# Altium schematic sheet SevenSegInterface.SchDoc
size A3; SheetNumber: 2; SheetTotal: 2
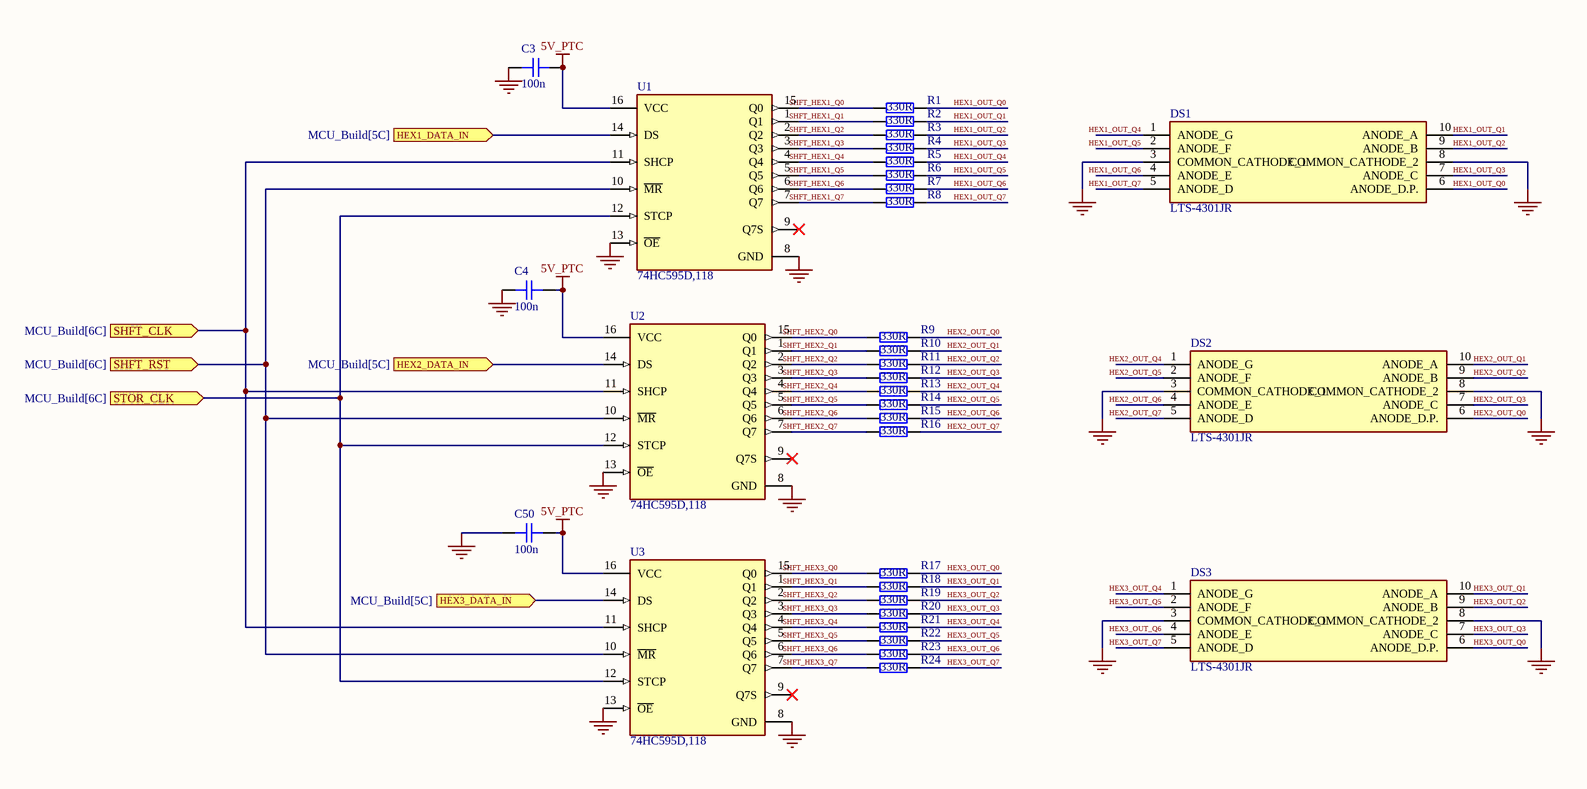
[diagram p0: SevenSegInterface.SchDoc]

## Parts
C3  100n  [CAP_0402]
C4  100n  [CAP_0402]
C50  100n  [CAP_0402]
DS1  LTS-4301JR  [DIPS762W50P254L1290H725Q10N]
DS2  LTS-4301JR  [DIPS762W50P254L1290H725Q10N]
DS3  LTS-4301JR  [DIPS762W50P254L1290H725Q10N]
R1  330R  [RES_0402]
R2  330R  [RES_0402]
R3  330R  [RES_0402]
R4  330R  [RES_0402]
R5  330R  [RES_0402]
R6  330R  [RES_0402]
R7  330R  [RES_0402]
R8  330R  [RES_0402]
R9  330R  [RES_0402]
R10  330R  [RES_0402]
R11  330R  [RES_0402]
R12  330R  [RES_0402]
R13  330R  [RES_0402]
R14  330R  [RES_0402]
R15  330R  [RES_0402]
R16  330R  [RES_0402]
R17  330R  [RES_0402]
R18  330R  [RES_0402]
R19  330R  [RES_0402]
R20  330R  [RES_0402]
R21  330R  [RES_0402]
R22  330R  [RES_0402]
R23  330R  [RES_0402]
R24  330R  [RES_0402]
U1  74HC595D,118  [FP-SOT109-1-IPC_C]
U2  74HC595D,118  [FP-SOT109-1-IPC_C]
U3  74HC595D,118  [FP-SOT109-1-IPC_C]

## Ports
HEX1_DATA_IN (in, see MCU_Build[5C]), HEX2_DATA_IN (in, see MCU_Build[5C]), HEX3_DATA_IN (in, see MCU_Build[5C]), SHFT_CLK (in, see MCU_Build[6C]), SHFT_RST (in, see MCU_Build[6C]), STOR_CLK (in, see MCU_Build[6C])

## Nets
5V_PTC: C3.1 C4.1 C50.1 U1.16(VCC) U2.16(VCC) U3.16(VCC)
GND: C3.2 C4.2 C50.2 DS1.3(COMMON_CATHODE_1) DS1.8(COMMON_CATHODE_2) DS2.3(COMMON_CATHODE_1) DS2.8(COMMON_CATHODE_2) DS3.3(COMMON_CATHODE_1) DS3.8(COMMON_CATHODE_2) U1.8(GND) U1.13(~{OE}) U2.8(GND) U2.13(~{OE}) U3.8(GND) U3.13(~{OE})
HEX1_DATA_IN: U1.14(DS) ; port HEX1_DATA_IN
HEX1_OUT_Q0: DS1.6(ANODE_D.P.) R1.1
HEX1_OUT_Q1: DS1.10(ANODE_A) R2.1
HEX1_OUT_Q2: DS1.9(ANODE_B) R3.1
HEX1_OUT_Q3: DS1.7(ANODE_C) R4.1
HEX1_OUT_Q4: DS1.1(ANODE_G) R5.1
HEX1_OUT_Q5: DS1.2(ANODE_F) R6.1
HEX1_OUT_Q6: DS1.4(ANODE_E) R7.1
HEX1_OUT_Q7: DS1.5(ANODE_D) R8.1
HEX2_DATA_IN: U2.14(DS) ; port HEX2_DATA_IN
HEX2_OUT_Q0: DS2.6(ANODE_D.P.) R9.1
HEX2_OUT_Q1: DS2.10(ANODE_A) R10.1
HEX2_OUT_Q2: DS2.9(ANODE_B) R11.1
HEX2_OUT_Q3: DS2.7(ANODE_C) R12.1
HEX2_OUT_Q4: DS2.1(ANODE_G) R13.1
HEX2_OUT_Q5: DS2.2(ANODE_F) R14.1
HEX2_OUT_Q6: DS2.4(ANODE_E) R15.1
HEX2_OUT_Q7: DS2.5(ANODE_D) R16.1
HEX3_DATA_IN: U3.14(DS) ; port HEX3_DATA_IN
HEX3_OUT_Q0: DS3.6(ANODE_D.P.) R17.1
HEX3_OUT_Q1: DS3.10(ANODE_A) R18.1
HEX3_OUT_Q2: DS3.9(ANODE_B) R19.1
HEX3_OUT_Q3: DS3.7(ANODE_C) R20.1
HEX3_OUT_Q4: DS3.1(ANODE_G) R21.1
HEX3_OUT_Q5: DS3.2(ANODE_F) R22.1
HEX3_OUT_Q6: DS3.4(ANODE_E) R23.1
HEX3_OUT_Q7: DS3.5(ANODE_D) R24.1
SHFT_CLK: U1.11(SHCP) U2.11(SHCP) U3.11(SHCP) ; port SHFT_CLK
SHFT_HEX1_Q0: R1.2 U1.15(Q0)
SHFT_HEX1_Q1: R2.2 U1.1(Q1)
SHFT_HEX1_Q2: R3.2 U1.2(Q2)
SHFT_HEX1_Q3: R4.2 U1.3(Q3)
SHFT_HEX1_Q4: R5.2 U1.4(Q4)
SHFT_HEX1_Q5: R6.2 U1.5(Q5)
SHFT_HEX1_Q6: R7.2 U1.6(Q6)
SHFT_HEX1_Q7: R8.2 U1.7(Q7)
SHFT_HEX2_Q0: R9.2 U2.15(Q0)
SHFT_HEX2_Q1: R10.2 U2.1(Q1)
SHFT_HEX2_Q2: R11.2 U2.2(Q2)
SHFT_HEX2_Q3: R12.2 U2.3(Q3)
SHFT_HEX2_Q4: R13.2 U2.4(Q4)
SHFT_HEX2_Q5: R14.2 U2.5(Q5)
SHFT_HEX2_Q6: R15.2 U2.6(Q6)
SHFT_HEX2_Q7: R16.2 U2.7(Q7)
SHFT_HEX3_Q0: R17.2 U3.15(Q0)
SHFT_HEX3_Q1: R18.2 U3.1(Q1)
SHFT_HEX3_Q2: R19.2 U3.2(Q2)
SHFT_HEX3_Q3: R20.2 U3.3(Q3)
SHFT_HEX3_Q4: R21.2 U3.4(Q4)
SHFT_HEX3_Q5: R22.2 U3.5(Q5)
SHFT_HEX3_Q6: R23.2 U3.6(Q6)
SHFT_HEX3_Q7: R24.2 U3.7(Q7)
SHFT_RST: U1.10(~{MR}) U2.10(~{MR}) U3.10(~{MR}) ; port SHFT_RST
STOR_CLK: U1.12(STCP) U2.12(STCP) U3.12(STCP) ; port STOR_CLK

Not connected (* = marked no-connect by the designer): U1 9(Q7S)*; U2 9(Q7S)*; U3 9(Q7S)*

## Library data of the parts
C3 C4 C50 = CAP_0402: Capacitor SMD 0402; Manufacturer: *; Manufacturer Part Number: *; Distributor Link: *; LCSC: *; Rating: *; Dielectric: *
DS1-DS3 = LTS-4301JR: Display; Manufacturer_Name: Lite-On; Datasheet Link: https://optoelectronics.liteon.com/upload/download/DS30-2001-029/S4301JR.pdf; Height: 7.25mm; Manufacturer_Part_Number: LTS-4301JR; Mouser Part Number: 859-LTS-4301JR; Mouser Price/Stock: https://www.mouser.co.uk/ProductDetail/LITEON/LTS-4301JR?qs=GfyGBZdkxqkE3FENS0xvwg%3D%3D; Arrow Part Number: LTS-4301JR; Arrow Price/Stock: https://www.arrow.com/en/products/lts-4301jr/lite-on-technology?utm_currency=USD&region=nac
R1-R24 = RES_0402: Resistor SMD 0402; Manufacturer: *; Manufacturer Part Number: *; Distributor Link: *; LCSC: *
U1-U3 = CMP-14351-000006-1: IC SHIFT REGISTER 8BIT 16SOIC; RoHS Compliant: Yes